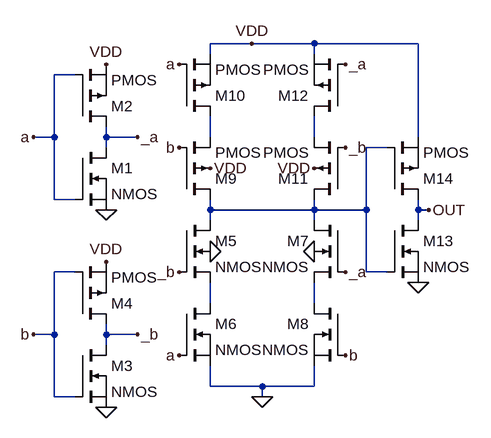
[diagram p0: schematic XOR_BUFF.asc]
XOR_BUFF.asc, the LTspice schematic file:
Version 4
SHEET 1 880 680
WIRE 304 -96 240 -96
WIRE 400 -96 304 -96
WIRE 560 -96 400 -96
WIRE 240 -80 240 -96
WIRE 400 -80 400 -96
WIRE 32 -48 0 -48
WIRE 0 48 0 -48
WIRE 0 48 -32 48
WIRE 80 48 80 32
WIRE 128 48 80 48
WIRE 240 48 240 16
WIRE 400 48 400 16
WIRE 560 48 560 -96
WIRE 80 64 80 48
WIRE 512 64 480 64
WIRE 0 144 0 48
WIRE 32 144 0 144
WIRE 240 160 240 144
WIRE 400 160 400 144
WIRE 400 160 240 160
WIRE 480 160 480 64
WIRE 480 160 400 160
WIRE 560 160 560 144
WIRE 576 160 560 160
WIRE 240 176 240 160
WIRE 400 176 400 160
WIRE 560 176 560 160
WIRE 32 256 0 256
WIRE 480 256 480 160
WIRE 512 256 480 256
WIRE 240 304 240 272
WIRE 400 304 400 272
WIRE 0 352 0 256
WIRE 0 352 -32 352
WIRE 80 352 80 336
WIRE 128 352 80 352
WIRE 80 368 80 352
WIRE 240 432 240 400
WIRE 320 432 240 432
WIRE 400 432 400 400
WIRE 400 432 320 432
WIRE 0 448 0 352
WIRE 32 448 0 448
WIRE 320 448 320 432
FLAG 80 160 0
FLAG 80 464 0
FLAG -32 48 a
FLAG -32 352 b
FLAG 320 448 0
FLAG 80 -64 VDD
FLAG 80 240 VDD
FLAG 192 -64 a
FLAG 192 384 a
FLAG 448 384 b
FLAG 192 64 b
FLAG 448 -64 _a
FLAG 448 256 _a
FLAG 192 256 _b
FLAG 448 64 _b
FLAG 128 352 _b
FLAG 128 48 _a
FLAG 304 -96 VDD
FLAG 576 160 OUT
FLAG 560 272 0
FLAG 240 224 0
FLAG 400 224 0
FLAG 240 96 VDD
FLAG 400 96 VDD
SYMBOL nmos 32 64 R0
SYMATTR InstName M1
SYMBOL pmos 32 32 M180
SYMATTR InstName M2
SYMBOL nmos 32 368 R0
SYMATTR InstName M3
SYMBOL pmos 32 336 M180
SYMATTR InstName M4
SYMBOL nmos 192 304 R0
SYMATTR InstName M6
SYMBOL nmos 448 304 M0
SYMATTR InstName M8
SYMBOL pmos 192 16 M180
SYMATTR InstName M10
SYMBOL pmos 448 16 R180
SYMATTR InstName M12
SYMBOL nmos 512 176 R0
SYMATTR InstName M13
SYMBOL pmos 512 144 M180
SYMATTR InstName M14
SYMBOL nmos4 192 176 R0
SYMATTR InstName M5
SYMBOL nmos4 448 176 M0
SYMATTR InstName M7
SYMBOL pmos4 192 144 M180
SYMATTR InstName M9
SYMBOL pmos4 448 144 R180
SYMATTR InstName M11

The netlist it stands for:
* XOR_BUFF.asc
M1 _a a 0 0 NMOS
M2 _a a VDD VDD PMOS
M3 _b b 0 0 NMOS
M4 _b b VDD VDD PMOS
M6 N004 a 0 0 NMOS
M8 N005 b 0 0 NMOS
M10 N001 a VDD VDD PMOS
M12 N002 _a VDD VDD PMOS
M13 OUT N003 0 0 NMOS
M14 OUT N003 VDD VDD PMOS
M5 N003 _b N004 0 NMOS
M7 N003 _a N005 0 NMOS
M9 N003 b N001 VDD PMOS
M11 N003 _b N002 VDD PMOS
.model NMOS NMOS
.model PMOS PMOS
.lib standard.mos
.backanno
.end